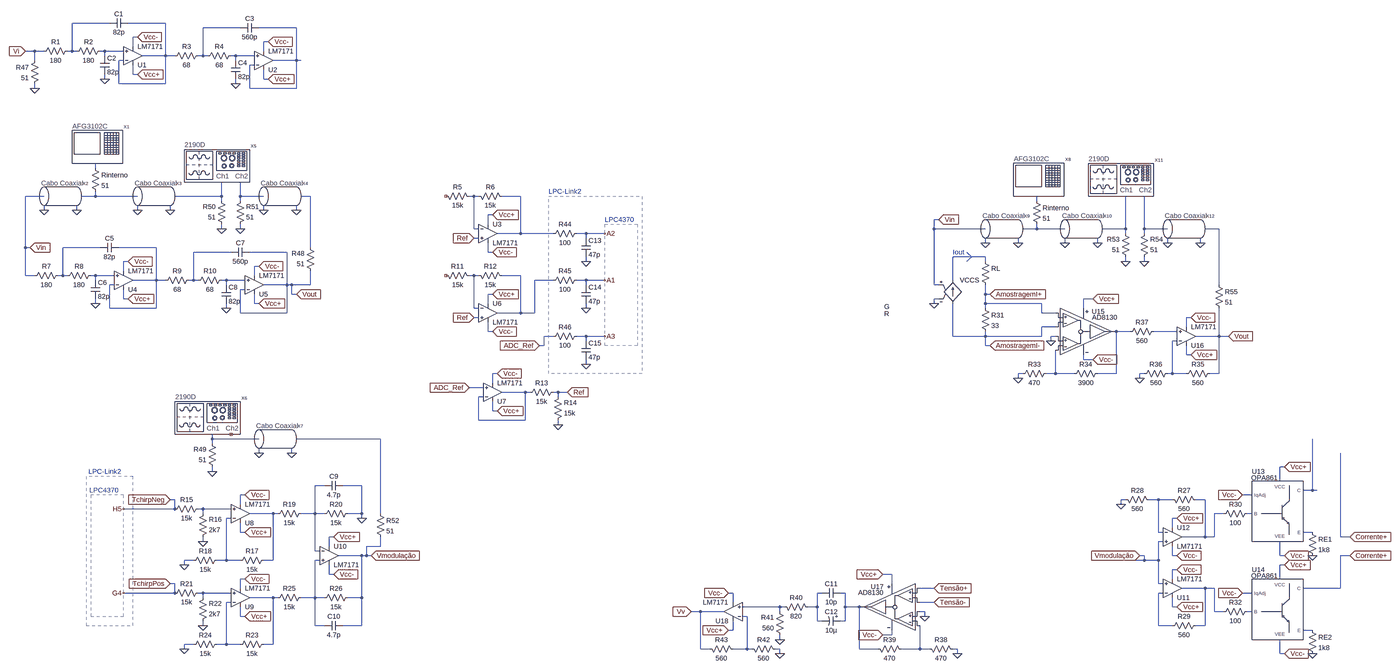
[diagram p0: schematic Circuitos de teste.asc, whole sheet]
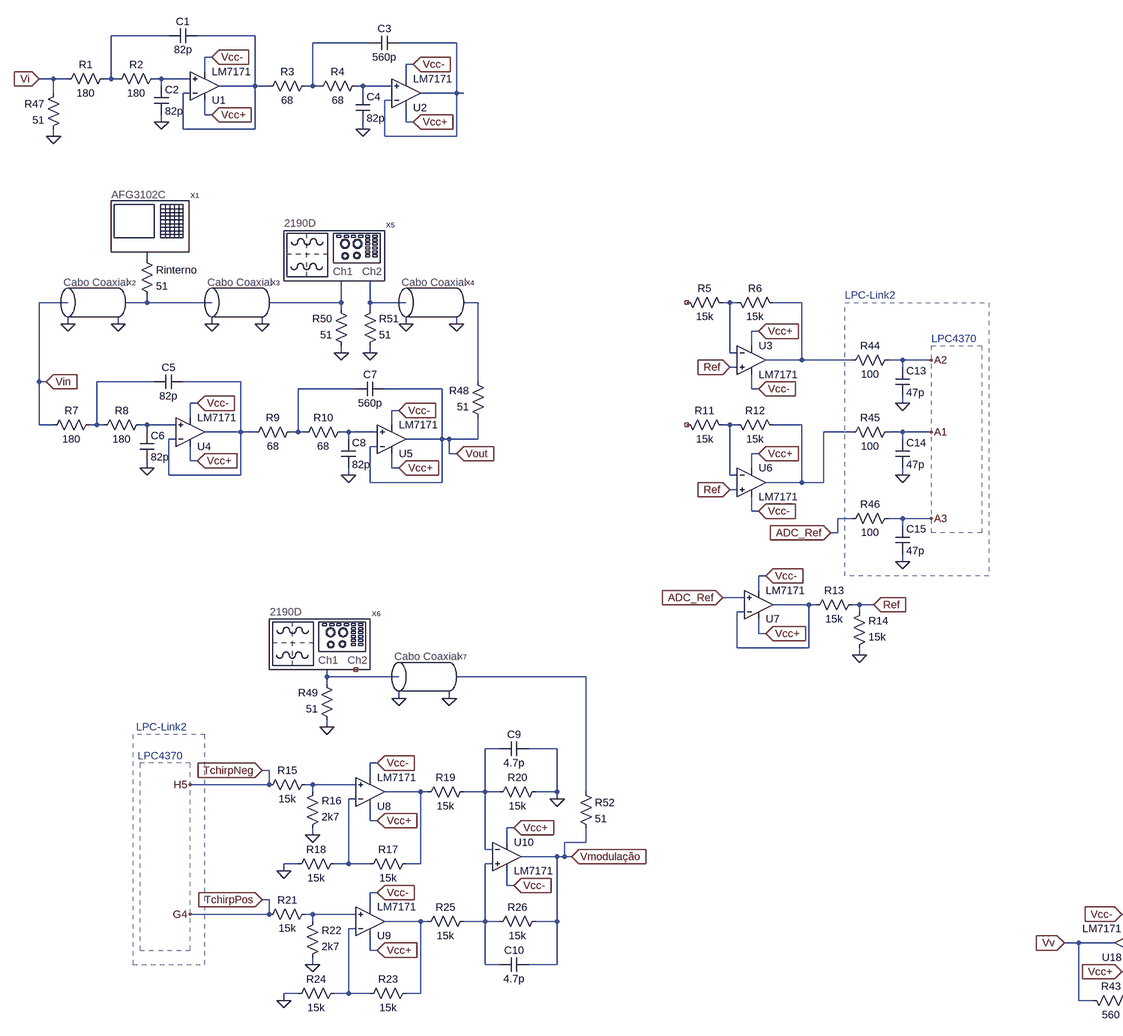
[diagram p1: schematic Circuitos de teste.asc, part, row 1 of 1, column 1 of 2]
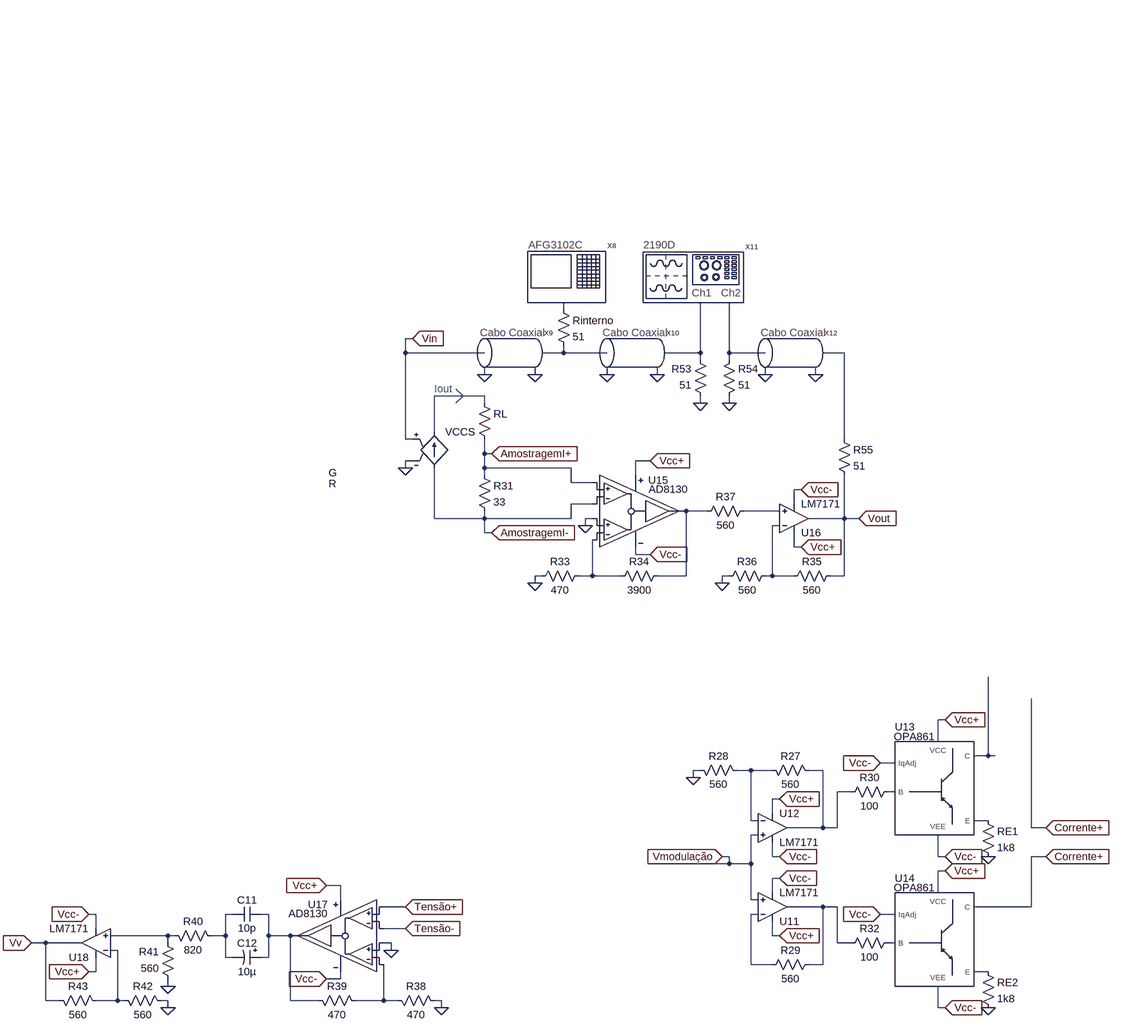
[diagram p2: schematic Circuitos de teste.asc, part, row 1 of 1, column 2 of 2]
Circuitos de teste.asc, the LTspice schematic file:
Version 4
SHEET 1 960 1024
WIRE -4784 -1520 -4912 -1520
WIRE -4592 -1520 -4720 -1520
WIRE -4336 -1504 -4464 -1504
WIRE -4144 -1504 -4272 -1504
WIRE -4688 -1472 -4704 -1472
WIRE -4240 -1456 -4256 -1456
WIRE -4704 -1440 -4704 -1472
WIRE -5040 -1424 -5072 -1424
WIRE -5008 -1424 -5040 -1424
WIRE -4912 -1424 -4912 -1520
WIRE -4912 -1424 -4928 -1424
WIRE -4896 -1424 -4912 -1424
WIRE -4800 -1424 -4816 -1424
WIRE -4736 -1424 -4800 -1424
WIRE -4256 -1424 -4256 -1456
WIRE -4800 -1408 -4800 -1424
WIRE -4592 -1408 -4592 -1520
WIRE -4592 -1408 -4672 -1408
WIRE -4560 -1408 -4592 -1408
WIRE -4464 -1408 -4464 -1504
WIRE -4464 -1408 -4480 -1408
WIRE -4448 -1408 -4464 -1408
WIRE -4352 -1408 -4368 -1408
WIRE -4288 -1408 -4352 -1408
WIRE -5040 -1392 -5040 -1424
WIRE -4736 -1392 -4752 -1392
WIRE -4352 -1392 -4352 -1408
WIRE -4144 -1392 -4144 -1504
WIRE -4144 -1392 -4224 -1392
WIRE -4128 -1392 -4144 -1392
WIRE -4288 -1376 -4304 -1376
WIRE -4704 -1344 -4704 -1376
WIRE -4688 -1344 -4704 -1344
WIRE -4800 -1328 -4800 -1344
WIRE -4256 -1328 -4256 -1360
WIRE -4240 -1328 -4256 -1328
WIRE -4752 -1312 -4752 -1392
WIRE -4592 -1312 -4592 -1408
WIRE -4592 -1312 -4752 -1312
WIRE -4352 -1312 -4352 -1328
WIRE -5040 -1296 -5040 -1312
WIRE -4304 -1296 -4304 -1376
WIRE -4144 -1296 -4144 -1392
WIRE -4144 -1296 -4304 -1296
WIRE -4832 -976 -4832 -992
WIRE -5008 -880 -5072 -880
WIRE -4832 -880 -4832 -896
WIRE -4832 -880 -4880 -880
WIRE -4688 -880 -4832 -880
WIRE -4400 -880 -4400 -928
WIRE -4400 -880 -4560 -880
WIRE -4336 -880 -4336 -928
WIRE -4256 -880 -4336 -880
WIRE -4096 -880 -4128 -880
WIRE -3536 -880 -3552 -880
WIRE -3520 -880 -3536 -880
WIRE -3376 -880 -3440 -880
WIRE -4400 -864 -4400 -880
WIRE -4336 -864 -4336 -880
WIRE -880 -864 -880 -880
WIRE -5008 -832 -5008 -848
WIRE -4896 -832 -4896 -848
WIRE -4688 -832 -4688 -848
WIRE -4576 -832 -4576 -848
WIRE -4256 -832 -4256 -848
WIRE -4144 -832 -4144 -848
WIRE -3472 -816 -3488 -816
WIRE -1216 -800 -1232 -800
WIRE -3488 -784 -3488 -816
WIRE -4400 -768 -4400 -784
WIRE -4336 -768 -4336 -784
WIRE -3536 -768 -3536 -880
WIRE -3520 -768 -3536 -768
WIRE -1232 -768 -1232 -800
WIRE -1056 -768 -1232 -768
WIRE -880 -768 -880 -784
WIRE -880 -768 -928 -768
WIRE -784 -768 -880 -768
WIRE -576 -768 -576 -880
WIRE -576 -768 -656 -768
WIRE -512 -768 -512 -880
WIRE -432 -768 -512 -768
WIRE -256 -768 -304 -768
WIRE -3376 -752 -3376 -880
WIRE -3376 -752 -3456 -752
WIRE -3264 -752 -3376 -752
WIRE -3152 -752 -3184 -752
WIRE -3088 -752 -3152 -752
WIRE -576 -752 -576 -768
WIRE -512 -752 -512 -768
WIRE -3520 -736 -3536 -736
WIRE -3152 -736 -3152 -752
WIRE -1056 -720 -1056 -736
WIRE -944 -720 -944 -736
WIRE -784 -720 -784 -736
WIRE -672 -720 -672 -736
WIRE -432 -720 -432 -736
WIRE -320 -720 -320 -736
WIRE -5072 -704 -5072 -880
WIRE -5056 -704 -5072 -704
WIRE -4816 -704 -4944 -704
WIRE -4624 -704 -4752 -704
WIRE -4096 -704 -4096 -880
WIRE -4368 -688 -4496 -688
WIRE -4176 -688 -4304 -688
WIRE -3488 -688 -3488 -720
WIRE -3472 -688 -3488 -688
WIRE -1056 -672 -1168 -672
WIRE -4720 -656 -4736 -656
WIRE -3152 -656 -3152 -672
WIRE -1056 -656 -1056 -672
WIRE -576 -656 -576 -672
WIRE -512 -656 -512 -672
WIRE -4272 -640 -4288 -640
WIRE -4736 -624 -4736 -656
WIRE -5072 -608 -5072 -704
WIRE -5040 -608 -5072 -608
WIRE -4944 -608 -4944 -704
WIRE -4944 -608 -4960 -608
WIRE -4928 -608 -4944 -608
WIRE -4832 -608 -4848 -608
WIRE -4768 -608 -4832 -608
WIRE -4288 -608 -4288 -640
WIRE -3536 -608 -3552 -608
WIRE -3520 -608 -3536 -608
WIRE -3376 -608 -3440 -608
WIRE -4832 -592 -4832 -608
WIRE -4624 -592 -4624 -704
WIRE -4624 -592 -4704 -592
WIRE -4592 -592 -4624 -592
WIRE -4496 -592 -4496 -688
WIRE -4496 -592 -4512 -592
WIRE -4480 -592 -4496 -592
WIRE -4384 -592 -4400 -592
WIRE -4320 -592 -4384 -592
WIRE -3264 -592 -3328 -592
WIRE -3152 -592 -3184 -592
WIRE -3088 -592 -3152 -592
WIRE -1168 -592 -1168 -672
WIRE -4768 -576 -4784 -576
WIRE -4384 -576 -4384 -592
WIRE -4176 -576 -4176 -688
WIRE -4176 -576 -4256 -576
WIRE -4160 -576 -4176 -576
WIRE -4096 -576 -4096 -624
WIRE -4096 -576 -4160 -576
WIRE -3152 -576 -3152 -592
WIRE -1232 -576 -1232 -768
WIRE -1216 -576 -1232 -576
WIRE -256 -576 -256 -768
WIRE -4320 -560 -4336 -560
WIRE -4160 -544 -4160 -576
WIRE -4144 -544 -4160 -544
WIRE -3472 -544 -3488 -544
WIRE -1056 -544 -1056 -576
WIRE -1040 -544 -1056 -544
WIRE -4736 -528 -4736 -560
WIRE -4720 -528 -4736 -528
WIRE -1216 -528 -1232 -528
WIRE -688 -528 -720 -528
WIRE -4832 -512 -4832 -528
WIRE -4288 -512 -4288 -544
WIRE -4272 -512 -4288 -512
WIRE -3488 -512 -3488 -544
WIRE -1232 -512 -1232 -528
WIRE -1056 -512 -1056 -544
WIRE -864 -512 -1056 -512
WIRE -4784 -496 -4784 -576
WIRE -4624 -496 -4624 -592
WIRE -4624 -496 -4784 -496
WIRE -4384 -496 -4384 -512
WIRE -3536 -496 -3536 -608
WIRE -3520 -496 -3536 -496
WIRE -3152 -496 -3152 -512
WIRE -1056 -496 -1056 -512
WIRE -720 -496 -720 -528
WIRE -4336 -480 -4336 -560
WIRE -4176 -480 -4176 -576
WIRE -4176 -480 -4336 -480
WIRE -3376 -480 -3376 -608
WIRE -3376 -480 -3456 -480
WIRE -3328 -480 -3328 -592
WIRE -3328 -480 -3376 -480
WIRE -864 -480 -864 -512
WIRE -816 -480 -864 -480
WIRE -3520 -464 -3536 -464
WIRE -352 -464 -368 -464
WIRE -816 -432 -864 -432
WIRE -368 -432 -368 -464
WIRE -3488 -416 -3488 -448
WIRE -3472 -416 -3488 -416
WIRE -560 -416 -608 -416
WIRE -400 -416 -480 -416
WIRE -3264 -400 -3296 -400
WIRE -3152 -400 -3184 -400
WIRE -3088 -400 -3152 -400
WIRE -1168 -400 -1168 -512
WIRE -1056 -400 -1056 -416
WIRE -1056 -400 -1168 -400
WIRE -864 -400 -864 -432
WIRE -864 -400 -1056 -400
WIRE -816 -400 -832 -400
WIRE -256 -400 -256 -496
WIRE -256 -400 -336 -400
WIRE -224 -400 -256 -400
WIRE -3152 -384 -3152 -400
WIRE -832 -384 -832 -400
WIRE -400 -384 -416 -384
WIRE -3296 -368 -3296 -400
WIRE -3296 -368 -3312 -368
WIRE -1056 -368 -1056 -400
WIRE -1040 -368 -1056 -368
WIRE -368 -336 -368 -368
WIRE -352 -336 -368 -336
WIRE -720 -320 -720 -336
WIRE -688 -320 -720 -320
WIRE -3152 -304 -3152 -320
WIRE -3456 -272 -3472 -272
WIRE -928 -272 -944 -272
WIRE -816 -272 -816 -352
WIRE -816 -272 -848 -272
WIRE -752 -272 -816 -272
WIRE -608 -272 -608 -416
WIRE -608 -272 -672 -272
WIRE -512 -272 -528 -272
WIRE -416 -272 -416 -384
WIRE -416 -272 -432 -272
WIRE -368 -272 -416 -272
WIRE -256 -272 -256 -400
WIRE -256 -272 -288 -272
WIRE -944 -256 -944 -272
WIRE -528 -256 -528 -272
WIRE -3472 -240 -3472 -272
WIRE -3504 -224 -3552 -224
WIRE -3360 -208 -3440 -208
WIRE -3344 -208 -3360 -208
WIRE -3248 -208 -3264 -208
WIRE -3216 -208 -3248 -208
WIRE -3504 -192 -3520 -192
WIRE -3248 -192 -3248 -208
WIRE -3472 -144 -3472 -176
WIRE -3456 -144 -3472 -144
WIRE -3520 -112 -3520 -192
WIRE -3360 -112 -3360 -208
WIRE -3360 -112 -3520 -112
WIRE -3248 -96 -3248 -112
WIRE -4432 -48 -4432 -64
WIRE -4272 -48 -4432 -48
WIRE -3856 -48 -4144 -48
WIRE -4432 -32 -4432 -48
WIRE -4272 0 -4272 -16
WIRE -4160 0 -4160 -16
WIRE -32 48 -48 48
WIRE -4432 64 -4432 48
WIRE -48 96 -48 48
WIRE -4048 112 -4080 112
WIRE -3920 112 -3984 112
WIRE 64 128 64 -48
WIRE 64 128 32 128
WIRE 80 128 64 128
WIRE -4320 144 -4336 144
WIRE -144 144 -176 144
WIRE -4560 160 -4576 160
WIRE -576 160 -592 160
WIRE -464 160 -496 160
WIRE -416 160 -464 160
WIRE -304 160 -336 160
WIRE -4336 176 -4336 144
WIRE -592 176 -592 160
WIRE -4560 192 -4560 160
WIRE -4560 192 -4736 192
WIRE -4464 192 -4480 192
WIRE -4368 192 -4464 192
WIRE -4464 208 -4464 192
WIRE -4224 208 -4304 208
WIRE -4208 208 -4224 208
WIRE -4080 208 -4080 112
WIRE -4080 208 -4128 208
WIRE -4048 208 -4080 208
WIRE -3920 208 -3920 112
WIRE -3920 208 -3968 208
WIRE -3856 208 -3856 -48
WIRE -240 208 -272 208
WIRE -144 208 -160 208
WIRE -4368 224 -4384 224
WIRE -3920 224 -3920 208
WIRE -400 224 -416 224
WIRE -416 256 -416 224
WIRE -4336 272 -4336 240
WIRE -4320 272 -4336 272
WIRE -464 272 -464 160
WIRE -448 272 -464 272
WIRE 64 272 32 272
WIRE -4016 288 -4032 288
WIRE -304 288 -304 160
WIRE -304 288 -384 288
WIRE -272 288 -272 208
WIRE -272 288 -304 288
WIRE 160 288 160 0
WIRE 192 288 160 288
WIRE -4464 304 -4464 288
WIRE -448 304 -464 304
WIRE -4032 320 -4032 288
WIRE -3856 320 -3856 288
WIRE -3856 320 -3904 320
WIRE -4080 336 -4080 208
WIRE -4064 336 -4080 336
WIRE -3920 352 -4000 352
WIRE -3904 352 -3904 320
WIRE -3904 352 -3920 352
WIRE -3888 352 -3904 352
WIRE -512 352 -528 352
WIRE -416 352 -416 320
WIRE -400 352 -416 352
WIRE -48 352 -48 304
WIRE -32 352 -48 352
WIRE 192 352 160 352
WIRE -4496 368 -4528 368
WIRE -4384 368 -4384 224
WIRE -4384 368 -4416 368
WIRE -4336 368 -4384 368
WIRE -4224 368 -4224 208
WIRE -4224 368 -4256 368
WIRE -4064 368 -4080 368
WIRE -512 368 -512 352
WIRE -512 368 -672 368
WIRE -464 368 -464 304
WIRE -464 368 -512 368
WIRE -4528 384 -4528 368
WIRE -32 384 -48 384
WIRE -400 400 -416 400
WIRE -4032 416 -4032 384
WIRE -4016 416 -4032 416
WIRE -1376 416 -1408 416
WIRE -4320 432 -4336 432
WIRE -416 432 -416 400
WIRE -48 432 -48 384
WIRE -4560 448 -4576 448
WIRE -1376 448 -1376 416
WIRE -464 448 -464 368
WIRE -448 448 -464 448
WIRE -4336 464 -4336 432
WIRE -1232 464 -1280 464
WIRE -304 464 -384 464
WIRE -272 464 -304 464
WIRE 160 464 160 352
WIRE 160 464 32 464
WIRE -4560 480 -4560 448
WIRE -4560 480 -4736 480
WIRE -4464 480 -4480 480
WIRE -4368 480 -4464 480
WIRE -1920 480 -1936 480
WIRE -1616 480 -1632 480
WIRE -1536 480 -1552 480
WIRE -448 480 -464 480
WIRE -144 480 -176 480
WIRE -4464 496 -4464 480
WIRE -4224 496 -4304 496
WIRE -4208 496 -4224 496
WIRE -4080 496 -4080 368
WIRE -4080 496 -4128 496
WIRE -4048 496 -4080 496
WIRE -3920 496 -3920 352
WIRE -3920 496 -3968 496
WIRE -4368 512 -4384 512
WIRE -1920 512 -1920 480
WIRE -1232 512 -1280 512
WIRE -1760 528 -1888 528
WIRE -1744 528 -1760 528
WIRE -1632 528 -1632 480
WIRE -1632 528 -1664 528
WIRE -1536 528 -1536 480
WIRE -1488 528 -1536 528
WIRE -416 528 -416 496
WIRE -400 528 -416 528
WIRE -2032 544 -2064 544
WIRE -1952 544 -2032 544
WIRE -1760 544 -1760 528
WIRE -1264 544 -1280 544
WIRE -272 544 -272 464
WIRE -240 544 -272 544
WIRE -144 544 -160 544
WIRE -4336 560 -4336 528
WIRE -4320 560 -4336 560
WIRE -1872 560 -1888 560
WIRE -1264 560 -1264 544
WIRE -1632 576 -1632 528
WIRE -1616 576 -1632 576
WIRE -1536 576 -1536 528
WIRE -1536 576 -1552 576
WIRE -4464 592 -4464 576
WIRE -4080 592 -4080 496
WIRE -4048 592 -4080 592
WIRE -3920 592 -3920 496
WIRE -3920 592 -3984 592
WIRE -464 592 -464 480
WIRE -416 592 -464 592
WIRE -304 592 -304 464
WIRE -304 592 -336 592
WIRE -1920 608 -1920 576
WIRE -1920 608 -1936 608
WIRE 64 608 32 608
WIRE -1376 624 -1376 608
WIRE -1376 624 -1408 624
WIRE -1760 640 -1760 624
WIRE -4496 656 -4528 656
WIRE -4384 656 -4384 512
WIRE -4384 656 -4416 656
WIRE -4336 656 -4384 656
WIRE -4224 656 -4224 496
WIRE -4224 656 -4256 656
WIRE -4528 672 -4528 656
WIRE -2032 672 -2032 544
WIRE -2000 672 -2032 672
WIRE -1872 672 -1872 560
WIRE -1872 672 -1920 672
WIRE -1856 672 -1872 672
WIRE -1760 672 -1776 672
WIRE -1488 672 -1488 528
WIRE -1424 672 -1488 672
WIRE -1280 672 -1280 592
WIRE -1280 672 -1344 672
WIRE -1248 672 -1280 672
WIRE -1152 672 -1168 672
WIRE -1760 688 -1760 672
WIRE -1152 688 -1152 672
WIRE -48 688 -48 640
WIRE -32 688 -48 688
FLAG -4800 -1328 0
FLAG -4688 -1344 Vcc+
IOPIN -4688 -1344 In
FLAG -4688 -1472 Vcc-
IOPIN -4688 -1472 In
FLAG -4352 -1312 0
FLAG -4240 -1328 Vcc+
IOPIN -4240 -1328 In
FLAG -4240 -1456 Vcc-
IOPIN -4240 -1456 In
FLAG -3472 -816 Vcc+
IOPIN -3472 -816 In
FLAG -3472 -688 Vcc-
IOPIN -3472 -688 In
FLAG -4832 -512 0
FLAG -4720 -528 Vcc+
IOPIN -4720 -528 In
FLAG -4720 -656 Vcc-
IOPIN -4720 -656 In
FLAG -4384 -496 0
FLAG -4272 -512 Vcc+
IOPIN -4272 -512 In
FLAG -4272 -640 Vcc-
IOPIN -4272 -640 In
FLAG -3472 -544 Vcc+
IOPIN -3472 -544 In
FLAG -3472 -416 Vcc-
IOPIN -3472 -416 In
FLAG -3456 -144 Vcc+
IOPIN -3456 -144 In
FLAG -3456 -272 Vcc-
IOPIN -3456 -272 In
FLAG -3248 -96 0
FLAG -3552 -224 ADC_Ref
IOPIN -3552 -224 In
FLAG -3216 -208 Ref
IOPIN -3216 -208 In
FLAG -3536 -464 Ref
IOPIN -3536 -464 In
FLAG -3536 -736 Ref
IOPIN -3536 -736 In
FLAG -4320 272 Vcc+
IOPIN -4320 272 In
FLAG -4320 144 Vcc-
IOPIN -4320 144 In
FLAG -4464 304 0
FLAG -4320 560 Vcc+
IOPIN -4320 560 In
FLAG -4320 432 Vcc-
IOPIN -4320 432 In
FLAG -4464 592 0
FLAG -4016 288 Vcc+
IOPIN -4016 288 In
FLAG -4016 416 Vcc-
IOPIN -4016 416 In
FLAG -3920 224 0
FLAG -4576 160 TchirpNeg
IOPIN -4576 160 In
FLAG -4576 448 TchirpPos
IOPIN -4576 448 In
FLAG -4528 672 0
FLAG -4528 384 0
FLAG -400 528 Vcc+
IOPIN -400 528 In
FLAG -400 400 Vcc-
IOPIN -400 400 In
FLAG -400 224 Vcc+
IOPIN -400 224 In
FLAG -400 352 Vcc-
IOPIN -400 352 In
FLAG -592 176 0
FLAG -32 352 Vcc-
IOPIN -32 352 In
FLAG -32 48 Vcc+
IOPIN -32 48 In
FLAG 64 352 0
FLAG -32 688 Vcc-
IOPIN -32 688 In
FLAG -32 384 Vcc+
IOPIN -32 384 In
FLAG 64 688 0
FLAG -176 144 Vcc-
IOPIN -176 144 In
FLAG -176 480 Vcc-
IOPIN -176 480 In
FLAG -832 -384 0
FLAG -944 -256 0
FLAG -352 -336 Vcc+
IOPIN -352 -336 In
FLAG -352 -464 Vcc-
IOPIN -352 -464 In
FLAG -528 -256 0
FLAG -688 -320 Vcc-
IOPIN -688 -320 In
FLAG -688 -528 Vcc+
IOPIN -688 -528 In
FLAG -1040 -368 AmostragemI-
IOPIN -1040 -368 In
FLAG -1040 -544 AmostragemI+
IOPIN -1040 -544 In
FLAG -1264 560 0
FLAG -1152 688 0
FLAG -1936 608 Vcc+
IOPIN -1936 608 In
FLAG -1936 480 Vcc-
IOPIN -1936 480 In
FLAG -1760 688 0
FLAG -1408 624 Vcc-
IOPIN -1408 624 In
FLAG -1408 416 Vcc+
IOPIN -1408 416 In
FLAG -1232 512 Tensão-
IOPIN -1232 512 In
FLAG -1232 464 Tensão+
IOPIN -1232 464 In
FLAG -1760 640 0
FLAG -224 -400 Vout
IOPIN -224 -400 In
FLAG -2064 544 Vv
IOPIN -2064 544 In
FLAG 192 352 Corrente+
IOPIN 192 352 In
FLAG 192 288 Corrente+
IOPIN 192 288 In
FLAG -3152 -656 0
FLAG -3152 -496 0
FLAG -5072 -1424 Vi
IOPIN -5072 -1424 In
FLAG -5056 -704 Vin
IOPIN -5056 -704 In
FLAG -3152 -304 0
FLAG -3312 -368 ADC_Ref
IOPIN -3312 -368 In
FLAG -3088 -752 A2
FLAG -3088 -592 A1
FLAG -3088 -400 A3
FLAG -528 352 Vmodulação
IOPIN -528 352 In
FLAG -3888 352 Vmodulação
IOPIN -3888 352 In
FLAG -4736 192 H5
FLAG -4736 480 G4
FLAG -5040 -1296 0
FLAG -5008 -832 0
FLAG -4896 -832 0
FLAG -4688 -832 0
FLAG -4576 -832 0
FLAG -4400 -768 0
FLAG -4336 -768 0
FLAG -4256 -832 0
FLAG -4144 -832 0
FLAG -4144 -544 Vout
IOPIN -4144 -544 In
FLAG -4432 64 0
FLAG -4272 0 0
FLAG -4160 0 0
FLAG -1056 -720 0
FLAG -944 -720 0
FLAG -784 -720 0
FLAG -672 -720 0
FLAG -576 -656 0
FLAG -512 -656 0
FLAG -432 -720 0
FLAG -320 -720 0
FLAG -1232 -512 0
FLAG -1216 -800 Vin
IOPIN -1216 -800 In
SYMBOL Opamps\\opamp2 -4704 -1344 M180
SYMATTR InstName U1
SYMATTR Value LM7171
SYMBOL res -4912 -1440 R90
WINDOW 0 0 56 VBottom 2
WINDOW 3 32 56 VTop 2
SYMATTR InstName R1
SYMATTR Value 180
SYMBOL res -4800 -1440 R90
WINDOW 0 0 56 VBottom 2
WINDOW 3 32 56 VTop 2
SYMATTR InstName R2
SYMATTR Value 180
SYMBOL cap -4720 -1536 R90
WINDOW 0 0 32 VBottom 2
WINDOW 3 32 32 VTop 2
SYMATTR InstName C1
SYMATTR Value 82p
SYMBOL cap -4816 -1408 R0
SYMATTR InstName C2
SYMATTR Value 82p
SYMBOL Opamps\\opamp2 -4256 -1328 M180
SYMATTR InstName U2
SYMATTR Value LM7171
SYMBOL res -4464 -1424 R90
WINDOW 0 0 56 VBottom 2
WINDOW 3 32 56 VTop 2
SYMATTR InstName R3
SYMATTR Value 68
SYMBOL res -4352 -1424 R90
WINDOW 0 0 56 VBottom 2
WINDOW 3 32 56 VTop 2
SYMATTR InstName R4
SYMATTR Value 68
SYMBOL cap -4272 -1520 R90
WINDOW 0 0 32 VBottom 2
WINDOW 3 32 32 VTop 2
SYMATTR InstName C3
SYMATTR Value 560p
SYMBOL cap -4368 -1392 R0
SYMATTR InstName C4
SYMATTR Value 82p
SYMBOL Opamps\\opamp2 -3488 -816 R0
SYMATTR InstName U3
SYMATTR Value LM7171
SYMBOL res -3536 -864 M270
WINDOW 0 32 56 VTop 2
WINDOW 3 0 56 VBottom 2
SYMATTR InstName R5
SYMATTR Value 15k
SYMBOL res -3424 -864 M270
WINDOW 0 32 56 VTop 2
WINDOW 3 0 56 VBottom 2
SYMATTR InstName R6
SYMATTR Value 15k
SYMBOL Opamps\\opamp2 -4736 -528 M180
SYMATTR InstName U4
SYMATTR Value LM7171
SYMBOL res -4944 -624 R90
WINDOW 0 0 56 VBottom 2
WINDOW 3 32 56 VTop 2
SYMATTR InstName R7
SYMATTR Value 180
SYMBOL res -4832 -624 R90
WINDOW 0 0 56 VBottom 2
WINDOW 3 32 56 VTop 2
SYMATTR InstName R8
SYMATTR Value 180
SYMBOL cap -4752 -720 R90
WINDOW 0 0 32 VBottom 2
WINDOW 3 32 32 VTop 2
SYMATTR InstName C5
SYMATTR Value 82p
SYMBOL cap -4848 -592 R0
SYMATTR InstName C6
SYMATTR Value 82p
SYMBOL Opamps\\opamp2 -4288 -512 M180
SYMATTR InstName U5
SYMATTR Value LM7171
SYMBOL res -4496 -608 R90
WINDOW 0 0 56 VBottom 2
WINDOW 3 32 56 VTop 2
SYMATTR InstName R9
SYMATTR Value 68
SYMBOL res -4384 -608 R90
WINDOW 0 0 56 VBottom 2
WINDOW 3 32 56 VTop 2
SYMATTR InstName R10
SYMATTR Value 68
SYMBOL cap -4304 -704 R90
WINDOW 0 0 32 VBottom 2
WINDOW 3 32 32 VTop 2
SYMATTR InstName C7
SYMATTR Value 560p
SYMBOL cap -4400 -576 R0
SYMATTR InstName C8
SYMATTR Value 82p
SYMBOL Opamps\\opamp2 -3488 -544 R0
SYMATTR InstName U6
SYMATTR Value LM7171
SYMBOL res -3536 -592 M270
WINDOW 0 32 56 VTop 2
WINDOW 3 0 56 VBottom 2
SYMATTR InstName R11
SYMATTR Value 15k
SYMBOL res -3424 -592 M270
WINDOW 0 32 56 VTop 2
WINDOW 3 0 56 VBottom 2
SYMATTR InstName R12
SYMATTR Value 15k
SYMBOL Opamps\\opamp2 -3472 -144 M180
SYMATTR InstName U7
SYMATTR Value LM7171
SYMBOL res -3248 -224 R90
WINDOW 0 0 56 VBottom 2
WINDOW 3 32 56 VTop 2
SYMATTR InstName R13
SYMATTR Value 15k
SYMBOL res -3264 -96 M180
WINDOW 0 36 76 Left 2
WINDOW 3 36 40 Left 2
SYMATTR InstName R14
SYMATTR Value 15k
SYMBOL Opamps\\opamp2 -4336 272 M180
SYMATTR InstName U8
SYMATTR Value LM7171
SYMBOL res -4464 176 R90
WINDOW 0 0 56 VBottom 2
WINDOW 3 32 56 VTop 2
SYMATTR InstName R15
SYMATTR Value 15k
SYMBOL res -4480 304 M180
WINDOW 0 36 76 Left 2
WINDOW 3 36 40 Left 2
SYMATTR InstName R16
SYMATTR Value 2k7
SYMBOL res -4240 352 R90
WINDOW 0 0 56 VBottom 2
WINDOW 3 32 56 VTop 2
SYMATTR InstName R17
SYMATTR Value 15k
SYMBOL res -4512 384 R270
WINDOW 0 32 56 VTop 2
WINDOW 3 0 56 VBottom 2
SYMATTR InstName R18
SYMATTR Value 15k
SYMBOL res -4112 192 R90
WINDOW 0 0 56 VBottom 2
WINDOW 3 32 56 VTop 2
SYMATTR InstName R19
SYMATTR Value 15k
SYMBOL res -3952 192 R90
WINDOW 0 0 56 VBottom 2
WINDOW 3 32 56 VTop 2
SYMATTR InstName R20
SYMATTR Value 15k
SYMBOL cap -3984 96 R90
WINDOW 0 0 32 VBottom 2
WINDOW 3 32 32 VTop 2
SYMATTR InstName C9
SYMATTR Value 4.7p
SYMBOL Opamps\\opamp2 -4336 560 M180
SYMATTR InstName U9
SYMATTR Value LM7171
SYMBOL res -4464 464 R90
WINDOW 0 0 56 VBottom 2
WINDOW 3 32 56 VTop 2
SYMATTR InstName R21
SYMATTR Value 15k
SYMBOL res -4480 592 M180
WINDOW 0 36 76 Left 2
WINDOW 3 36 40 Left 2
SYMATTR InstName R22
SYMATTR Value 2k7
SYMBOL res -4240 640 R90
WINDOW 0 0 56 VBottom 2
WINDOW 3 32 56 VTop 2
SYMATTR InstName R23
SYMATTR Value 15k
SYMBOL res -4512 672 R270
WINDOW 0 32 56 VTop 2
WINDOW 3 0 56 VBottom 2
SYMATTR InstName R24
SYMATTR Value 15k
SYMBOL Opamps\\opamp2 -4032 288 R0
SYMATTR InstName U10
SYMATTR Value LM7171
SYMBOL res -4112 480 R90
WINDOW 0 0 56 VBottom 2
WINDOW 3 32 56 VTop 2
SYMATTR InstName R25
SYMATTR Value 15k
SYMBOL res -3952 480 R90
WINDOW 0 0 56 VBottom 2
WINDOW 3 32 56 VTop 2
SYMATTR InstName R26
SYMATTR Value 15k
SYMBOL cap -3984 576 R90
WINDOW 0 0 32 VBottom 2
WINDOW 3 32 32 VTop 2
SYMATTR InstName C10
SYMATTR Value 4.7p
SYMBOL Opamps\\opamp2 -416 528 M180
SYMATTR InstName U11
SYMATTR Value LM7171
SYMBOL res -320 576 R90
WINDOW 0 0 56 VBottom 2
WINDOW 3 32 56 VTop 2
SYMATTR InstName R29
SYMATTR Value 560
SYMBOL Opamps\\opamp2 -416 224 R0
SYMATTR InstName U12
SYMATTR Value LM7171
SYMBOL res -320 176 M270
WINDOW 0 32 56 VTop 2
WINDOW 3 0 56 VBottom 2
SYMATTR InstName R27
SYMATTR Value 560
SYMBOL res -480 176 M270
WINDOW 0 32 56 VTop 2
WINDOW 3 0 56 VBottom 2
SYMATTR InstName R28
SYMATTR Value 560
SYMBOL opa681 -80 240 R0
SYMATTR InstName U13
SYMBOL res 48 256 R0
SYMATTR InstName RE1
SYMATTR Value 1k8
SYMBOL res -144 192 R90
WINDOW 0 0 56 VBottom 2
WINDOW 3 32 56 VTop 2
SYMATTR InstName R30
SYMATTR Value 100
SYMBOL opa681 -80 576 R0
SYMATTR InstName U14
SYMBOL res 48 592 R0
SYMATTR InstName RE2
SYMATTR Value 1k8
SYMBOL res -144 528 R90
WINDOW 0 0 56 VBottom 2
WINDOW 3 32 56 VTop 2
SYMATTR InstName R32
SYMATTR Value 100
SYMBOL res -1072 -512 R0
SYMATTR InstName R31
SYMATTR Value 33
SYMBOL ad8130 -736 -416 R0
SYMATTR InstName U15
SYMBOL res -832 -288 R90
WINDOW 0 0 56 VBottom 2
WINDOW 3 32 56 VTop 2
SYMATTR InstName R33
SYMATTR Value 470
SYMBOL res -656 -288 R90
WINDOW 0 0 56 VBottom 2
WINDOW 3 32 56 VTop 2
SYMATTR InstName R34
SYMATTR Value 3900
SYMBOL res -464 -432 R90
WINDOW 0 0 56 VBottom 2
WINDOW 3 32 56 VTop 2
SYMATTR InstName R37
SYMATTR Value 560
SYMBOL Opamps\\opamp2 -368 -336 M180
SYMATTR InstName U16
SYMATTR Value LM7171
SYMBOL res -272 -288 R90
WINDOW 0 0 56 VBottom 2
WINDOW 3 32 56 VTop 2
SYMATTR InstName R35
SYMATTR Value 560
SYMBOL res -416 -288 R90
WINDOW 0 0 56 VBottom 2
WINDOW 3 32 56 VTop 2
SYMATTR InstName R36
SYMATTR Value 560
SYMBOL ad8130 -1360 528 M0
SYMATTR InstName U17
SYMBOL res -1264 656 M90
WINDOW 0 0 56 VBottom 2
WINDOW 3 32 56 VTop 2
SYMATTR InstName R38
SYMATTR Value 470
SYMBOL res -1440 656 M90
WINDOW 0 0 56 VBottom 2
WINDOW 3 32 56 VTop 2
SYMATTR InstName R39
SYMATTR Value 470
SYMBOL res -1760 512 M90
WINDOW 0 0 56 VBottom 2
WINDOW 3 32 56 VTop 2
SYMATTR InstName R40
SYMATTR Value 820
SYMBOL Opamps\\opamp2 -1920 608 R180
SYMATTR InstName U18
SYMATTR Value LM7171
SYMBOL res -2016 656 M90
WINDOW 0 0 56 VBottom 2
WINDOW 3 32 56 VTop 2
SYMATTR InstName R43
SYMATTR Value 560
SYMBOL res -1872 656 M90
WINDOW 0 0 56 VBottom 2
WINDOW 3 32 56 VTop 2
SYMATTR InstName R42
SYMATTR Value 560
SYMBOL cap -1616 464 M90
WINDOW 0 0 32 VBottom 2
WINDOW 3 32 32 VTop 2
SYMATTR InstName C11
SYMATTR Value 10p
SYMBOL polcap -1552 560 R90
WINDOW 0 0 32 VBottom 2
WINDOW 3 32 32 VTop 2
SYMATTR InstName C12
SYMATTR Value 10µ
SYMATTR Description Capacitor
SYMATTR Type cap
SYMATTR SpiceLine V=4 Irms=3.72678 Rser=0.018 Lser=0 mfg="KEMET" pn="A700D107M004ATE018" type="Al electrolytic"
SYMBOL res -1744 640 R180
WINDOW 0 36 76 Left 2
WINDOW 3 36 40 Left 2
SYMATTR InstName R41
SYMATTR Value 560
SYMBOL res -3168 -768 R90
WINDOW 0 0 56 VBottom 2
WINDOW 3 32 56 VTop 2
SYMATTR InstName R44
SYMATTR Value 100
SYMBOL cap -3168 -736 R0
SYMATTR InstName C13
SYMATTR Value 47p
SYMBOL res -3168 -608 R90
WINDOW 0 0 56 VBottom 2
WINDOW 3 32 56 VTop 2
SYMATTR InstName R45
SYMATTR Value 100
SYMBOL cap -3168 -576 R0
SYMATTR InstName C14
SYMATTR Value 47p
SYMBOL res -3168 -416 R90
WINDOW 0 0 56 VBottom 2
WINDOW 3 32 56 VTop 2
SYMATTR InstName R46
SYMATTR Value 100
SYMBOL cap -3168 -384 R0
SYMATTR InstName C15
SYMATTR Value 47p
SYMBOL res -5024 -1408 M0
SYMATTR InstName R47
SYMATTR Value 51
SYMBOL afg3102c -4912 -992 R0
SYMATTR InstName X1
SYMBOL coaxialCable -5024 -848 R0
SYMATTR InstName X2
SYMBOL res -4080 -608 R180
WINDOW 0 36 76 Left 2
WINDOW 3 36 40 Left 2
SYMATTR InstName R48
SYMATTR Value 51
SYMBOL res -4848 -992 R0
SYMATTR InstName Rinterno
SYMATTR Value 51
SYMBOL coaxialCable -4704 -848 R0
SYMATTR InstName X3
SYMBOL osc -4528 -928 R0
SYMATTR InstName X5
SYMBOL res -4384 -768 R180
WINDOW 0 36 76 Left 2
WINDOW 3 36 40 Left 2
SYMATTR InstName R50
SYMATTR Value 51
SYMBOL res -4352 -768 M180
WINDOW 0 36 76 Left 2
WINDOW 3 36 40 Left 2
SYMATTR InstName R51
SYMATTR Value 51
SYMBOL coaxialCable -4272 -848 R0
SYMATTR InstName X4
SYMBOL osc -4560 -64 R0
SYMATTR InstName X6
SYMBOL res -4416 64 R180
WINDOW 0 36 76 Left 2
WINDOW 3 36 40 Left 2
SYMATTR InstName R49
SYMATTR Value 51
SYMBOL coaxialCable -4288 -16 R0
SYMATTR InstName X7
SYMBOL res -3872 192 R0
SYMATTR InstName R52
SYMATTR Value 51
SYMBOL afg3102c -960 -880 R0
SYMATTR InstName X8
SYMBOL coaxialCable -1072 -736 R0
SYMATTR InstName X9
SYMBOL res -896 -880 R0
SYMATTR InstName Rinterno
SYMATTR Value 51
SYMBOL coaxialCable -800 -736 R0
SYMATTR InstName X10
SYMBOL osc -704 -880 R0
SYMATTR InstName X11
SYMBOL res -560 -656 R180
WINDOW 0 36 76 Left 2
WINDOW 3 36 40 Left 2
SYMATTR InstName R53
SYMATTR Value 51
SYMBOL res -528 -656 M180
WINDOW 0 36 76 Left 2
WINDOW 3 36 40 Left 2
SYMATTR InstName R54
SYMATTR Value 51
SYMBOL coaxialCable -448 -736 R0
SYMATTR InstName X12
SYMBOL res -272 -592 R0
SYMATTR InstName R55
SYMATTR Value 51
SYMBOL g -1168 -608 R0
WINDOW 3 -235 107 Left 2
SYMATTR InstName VCCS
SYMBOL res -1072 -672 R0
WINDOW 3 -331 195 Left 2
SYMATTR InstName RL
TEXT -3280 -896 Left 2 ;LPC-Link2
TEXT -3088 -800 Left 2 ;LPC4370
TEXT -4744 64 Right 2 ;LPC-Link2
TEXT -4752 128 Right 2 ;LPC4370
TEXT -1168 -688 Left 2 ;Iout
LINE Normal -1120 -688 -1104 -672
LINE Normal -1104 -672 -1120 -688 2
LINE Normal -1104 -672 -1104 -672 2
LINE Normal -1120 -656 -1104 -672
RECTANGLE Normal -2960 -272 -3280 -880 2
RECTANGLE Normal -2976 -368 -3088 -784 2
RECTANGLE Normal -4864 592 -4704 80 2
RECTANGLE Normal -4848 560 -4736 144 2

The netlist it stands for:
* Circuitos de teste.asc
XU1 N005 N002 Vcc+ Vcc- N002 LM7171  ; pins In+ In- V+ V- OUT
R1 N001 Vi 180
R2 N005 N001 180
C1 N002 N001 82p
C2 N005 0 82p
XU2 N006 N004 Vcc+ Vcc- N004 LM7171  ; pins In+ In- V+ V- OUT
R3 N003 N002 68
R4 N006 N003 68
C3 N004 N003 560p
C4 N006 0 82p
XU3 Ref N012 Vcc+ Vcc- N013 LM7171  ; pins In+ In- V+ V- OUT
R5 N012 NC_01 15k
R6 N013 N012 15k
XU4 N023 N020 Vcc+ Vcc- N020 LM7171  ; pins In+ In- V+ V- OUT
R7 N019 Vin 180
R8 N023 N019 180
C5 N020 N019 82p
C6 N023 0 82p
XU5 N026 Vout Vcc+ Vcc- Vout LM7171  ; pins In+ In- V+ V- OUT
R9 N021 N020 68
R10 N026 N021 68
C7 Vout N021 560p
C8 N026 0 82p
XU6 Ref N024 Vcc+ Vcc- N025 LM7171  ; pins In+ In- V+ V- OUT
R11 N024 NC_02 15k
R12 N025 N024 15k
XU7 ADC_Ref N031 Vcc+ Vcc- N031 LM7171  ; pins In+ In- V+ V- OUT
R13 Ref N031 15k
R14 0 Ref 15k
XU8 N038 N041 Vcc+ Vcc- N039 LM7171  ; pins In+ In- V+ V- OUT
R15 N038 H5 15k
R16 0 N038 2k7
R17 N039 N041 15k
R18 0 N041 15k
R19 N034 N039 15k
R20 0 N034 15k
C9 0 N034 4.7p
XU9 N045 N050 Vcc+ Vcc- N049 LM7171  ; pins In+ In- V+ V- OUT
R21 N045 G4 15k
R22 0 N045 2k7
R23 N049 N050 15k
R24 0 N050 15k
XU10 N043 N034 Vcc+ Vcc- Vmodulação LM7171  ; pins In+ In- V+ V- OUT
R25 N043 N049 15k
R26 Vmodulação N043 15k
C10 Vmodulação N043 4.7p
XU11 Vmodulação N048 Vcc+ Vcc- N044 LM7171  ; pins In+ In- V+ V- OUT
R29 N044 N048 560
XU12 Vmodulação N036 Vcc+ Vcc- N037 LM7171  ; pins In+ In- V+ V- OUT
R27 N037 N036 560
R28 N036 0 560
XU13 N040 N035 N042 Vcc- Vcc+ Vcc- OPA861  ; pins B C E IqAdj VCC VEE
RE1 N042 0 1k8
R30 N040 N037 100
XU14 N052 Corrente+ N054 Vcc- Vcc+ Vcc- OPA861  ; pins B C E IqAdj VCC VEE
RE2 N054 0 1k8
R32 N052 N044 100
R31 AmostragemI+ AmostragemI- 33
XU15 AmostragemI+ AmostragemI- 0 N030 Vcc+ Vcc- N027 AD8130  ; pins 1 2 3 4 99 50 45
R33 N030 0 470
R34 N027 N030 3900
R37 N028 N027 560
XU16 N028 N029 Vcc+ Vcc- Vout LM7171  ; pins In+ In- V+ V- OUT
R35 Vout N029 560
R36 N029 0 560
XU17 Tensão+ Tensão- 0 N055 Vcc+ Vcc- N047 AD8130  ; pins 1 2 3 4 99 50 45
R38 N055 0 470
R39 N047 N055 470
R40 N051 N046 820
XU18 N051 N053 Vcc+ Vcc- Vv LM7171  ; pins In+ In- V+ V- OUT
R43 Vv N053 560
R42 N053 0 560
C11 N046 N047 10p
C12 N047 N046 10µ V=4 Irms=3.72678 Rser=0.018 Lser=0 mfg="KEMET" pn="A700D107M004ATE018" type="Al electrolytic"
R41 0 N051 560
R44 A2 N013 100
C13 A2 0 47p
R45 A1 N025 100
C14 A1 0 47p
R46 A3 ADC_Ref 100
C15 A3 0 47p
R47 Vi 0 51
XX1 N007 afg3102c
XX2 Vin 0 0 N008 coaxialCable
R48 Vout N011 51
Rinterno N007 N008 51
XX3 N008 0 0 N009 coaxialCable
XX5 N009 N010 osc
R50 0 N009 51
R51 0 N010 51
XX4 N010 0 0 N011 coaxialCable
XX6 N032 NC_03 osc
R49 0 N032 51
XX7 N032 0 0 N033 coaxialCable
R52 N033 Vmodulação 51
XX8 N014 afg3102c
XX9 Vin 0 0 N015 coaxialCable
Rinterno N014 N015 51
XX10 N015 0 0 N016 coaxialCable
XX11 N016 N017 osc
R53 0 N016 51
R54 0 N017 51
XX12 N017 0 0 N018 coaxialCable
R55 N018 Vout 51
G§VCCS AmostragemI- N022 Vin 0 G
RL N022 AmostragemI+ R
* LPC-Link2
* LPC4370
* LPC-Link2
* LPC4370
* Iout
.lib .\OPA861Model.sub
.lib .\ad8130.cir
.backanno
.end